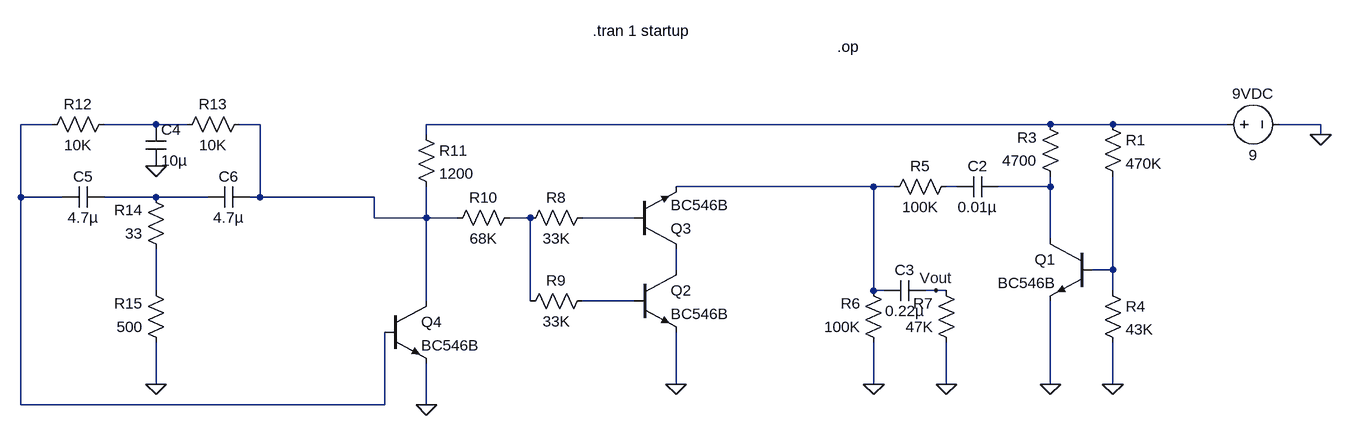
[diagram p0: schematic kay_tremolo.asc]
kay_tremolo.asc, the LTspice schematic file:
Version 4
SHEET 1 980 680
WIRE -1088 176 -1136 176
WIRE -928 176 -1008 176
WIRE -880 176 -928 176
WIRE -768 176 -800 176
WIRE 448 176 -512 176
WIRE 544 176 448 176
WIRE 720 176 544 176
WIRE 864 176 800 176
WIRE -512 192 -512 176
WIRE 864 192 864 176
WIRE 176 272 -128 272
WIRE 208 272 176 272
WIRE 304 272 288 272
WIRE 448 272 448 256
WIRE 448 272 368 272
WIRE -1136 288 -1136 176
WIRE -1072 288 -1136 288
WIRE -928 288 -1008 288
WIRE -848 288 -928 288
WIRE -768 288 -768 176
WIRE -768 288 -784 288
WIRE -592 288 -768 288
WIRE -592 320 -592 288
WIRE -512 320 -512 272
WIRE -512 320 -592 320
WIRE -464 320 -512 320
WIRE -352 320 -384 320
WIRE -192 320 -272 320
WIRE 448 352 448 272
WIRE -128 400 -128 368
WIRE 544 400 544 256
WIRE 544 400 512 400
WIRE -928 432 -928 368
WIRE 176 432 176 272
WIRE 192 432 176 432
WIRE 272 432 256 432
WIRE 288 432 272 432
WIRE 544 432 544 400
WIRE -512 448 -512 320
WIRE -352 448 -352 320
WIRE -192 448 -272 448
WIRE -928 576 -928 512
WIRE -128 576 -128 496
WIRE 176 576 176 512
WIRE 288 576 288 512
WIRE 448 576 448 448
WIRE 544 576 544 512
WIRE -1136 608 -1136 288
WIRE -576 608 -576 496
WIRE -576 608 -1136 608
WIRE -512 608 -512 544
FLAG -128 576 0
FLAG 176 576 0
FLAG -928 576 0
FLAG -928 240 0
FLAG 288 576 0
FLAG 448 576 0
FLAG 544 576 0
FLAG 864 192 0
FLAG -512 608 0
FLAG 272 432 Vout
DATAFLAG -208 336 ""
DATAFLAG -240 448 ""
DATAFLAG -256 320 ""
DATAFLAG 656 176 ""
DATAFLAG 64 272 ""
DATAFLAG 64 272 ""
DATAFLAG -512 288 ""
DATAFLAG -512 288 ""
DATAFLAG 16 176 ""
DATAFLAG -656 288 ""
DATAFLAG -656 288 ""
DATAFLAG -864 288 ""
DATAFLAG -992 176 ""
DATAFLAG 448 176 ""
DATAFLAG -128 384 ""
DATAFLAG 448 272 ""
DATAFLAG 544 400 ""
DATAFLAG 176 432 ""
DATAFLAG 272 432 ""
SYMBOL voltage 704 176 R270
WINDOW 0 32 56 VTop 2
WINDOW 3 -32 56 VBottom 2
SYMATTR InstName 9VDC
SYMATTR Value 9
SYMBOL res 528 160 R0
SYMATTR InstName R1
SYMATTR Value 470K
SYMBOL res 464 272 R180
WINDOW 0 36 76 Left 2
WINDOW 3 36 40 Left 2
SYMATTR InstName R3
SYMATTR Value 4700
SYMBOL res 528 416 R0
SYMATTR InstName R4
SYMATTR Value 43K
SYMBOL npn 512 352 M0
SYMATTR InstName Q1
SYMATTR Value BC546B
SYMBOL cap 368 256 R90
WINDOW 0 0 32 VBottom 2
WINDOW 3 32 32 VTop 2
SYMATTR InstName C2
SYMATTR Value 0.01µ
SYMBOL cap 192 448 R270
WINDOW 0 32 32 VTop 2
WINDOW 3 0 32 VBottom 2
SYMATTR InstName C3
SYMATTR Value 0.22µ
SYMBOL res 304 256 R90
WINDOW 0 0 56 VBottom 2
WINDOW 3 32 56 VTop 2
SYMATTR InstName R5
SYMATTR Value 100K
SYMBOL res 192 528 R180
WINDOW 0 36 76 Left 2
WINDOW 3 36 40 Left 2
SYMATTR InstName R6
SYMATTR Value 100K
SYMBOL res 304 528 R180
WINDOW 0 36 76 Left 2
WINDOW 3 36 40 Left 2
SYMATTR InstName R7
SYMATTR Value 47K
SYMBOL npn -192 400 R0
SYMATTR InstName Q2
SYMATTR Value BC546B
SYMBOL npn -192 368 M180
SYMATTR InstName Q3
SYMATTR Value BC546B
SYMBOL res -256 304 R90
WINDOW 0 0 56 VBottom 2
WINDOW 3 32 56 VTop 2
SYMATTR InstName R8
SYMATTR Value 33K
SYMBOL res -256 432 R90
WINDOW 0 0 56 VBottom 2
WINDOW 3 32 56 VTop 2
SYMATTR InstName R9
SYMATTR Value 33K
SYMBOL res -368 304 R90
WINDOW 0 0 56 VBottom 2
WINDOW 3 32 56 VTop 2
SYMATTR InstName R10
SYMATTR Value 68K
SYMBOL res -528 176 R0
SYMATTR InstName R11
SYMATTR Value 1200
SYMBOL res -992 160 R90
WINDOW 0 0 56 VBottom 2
WINDOW 3 32 56 VTop 2
SYMATTR InstName R12
SYMATTR Value 10K
SYMBOL res -784 160 R90
WINDOW 0 0 56 VBottom 2
WINDOW 3 32 56 VTop 2
SYMATTR InstName R13
SYMATTR Value 10K
SYMBOL res -912 384 R180
WINDOW 0 36 76 Left 2
WINDOW 3 36 40 Left 2
SYMATTR InstName R14
SYMATTR Value 33
SYMBOL res -912 528 R180
WINDOW 0 36 76 Left 2
WINDOW 3 36 40 Left 2
SYMATTR InstName R15
SYMATTR Value 500
SYMBOL cap -944 176 R0
SYMATTR InstName C4
SYMATTR Value 10µ
SYMBOL cap -1072 304 R270
WINDOW 0 32 32 VTop 2
WINDOW 3 0 32 VBottom 2
SYMATTR InstName C5
SYMATTR Value 4.7µ
SYMBOL cap -784 272 R90
WINDOW 0 0 32 VBottom 2
WINDOW 3 32 32 VTop 2
SYMATTR InstName C6
SYMATTR Value 4.7µ
SYMBOL npn -576 448 R0
SYMATTR InstName Q4
SYMATTR Value BC546B
TEXT 120 56 Left 2 !.op
TEXT -256 32 Left 2 !.tran 1 startup

The netlist it stands for:
* kay_tremolo.asc
V§9VDC N004 0 9
R1 N004 N012 470K
R3 N007 N004 4700
R4 N012 0 43K
Q1 N007 N012 0 0 BC546B
C2 N007 N006 0.01µ
C3 N005 Vout 0.22µ
R5 N006 N005 100K
R6 0 N005 100K
R7 0 Vout 47K
Q2 N011 N014 0 0 BC546B
Q3 N011 N010 N005 0 BC546B
R8 N010 N009 33K
R9 N014 N009 33K
R10 N009 N003 68K
R11 N004 N003 1200
R12 N002 N001 10K
R13 N003 N002 10K
R14 N013 N008 33
R15 0 N013 500
C4 N002 0 10µ
C5 N001 N008 4.7µ
C6 N003 N008 4.7µ
Q4 N003 N001 0 0 BC546B
.model NPN NPN
.model PNP PNP
.lib standard.bjt
.op
.tran 1 startup
.backanno
.end